# Altium schematic sheet Power.SchDoc
size A4
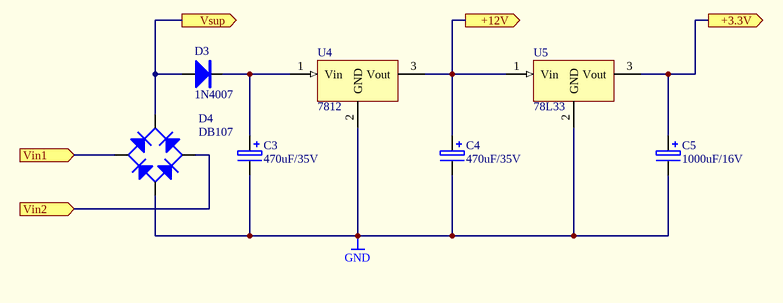
[diagram p0: Power.SchDoc]

## Parts
C3  470uF/35V  [EC10x20]
C4  470uF/35V  [EC8x16]
C5  1000uF/16V  [EC6.3x12]
D3  1N4007  [R400_V]
D4  DB107  [BRIDGE_PTH]
U4  7812  [TO-220-V]
U5  78L33  [IC_TO-92]

## Ports
+3.3V (out), +12V (out), Vin1 (in), Vin2 (in), Vsup (out)

## Nets
GND: C3.2 C4.2 C5.2 D4.4(M) U4.2(GND) U5.2(GND)
+3.3V: C5.1 U5.3(Vout) ; port +3.3V
+12V: C4.1 U4.3(Vout) U5.1(Vin) ; port +12V
Vin1: D4.1(AC1) ; port Vin1
Vin2: D4.2(AC2) ; port Vin2
Vsup: D3.1(A) D4.3(P) ; port Vsup
NetC3_1: C3.1 D3.2(K) U4.1(Vin)

## Library data of the parts
C3-C5 = ELECTRO1: Electrolytic Capacitor
D3 = DIODE
D4 = BRIDGE
U4 U5 = 78XX